# Altium schematic sheet Interface_Accelerometer_2.SchDoc
size A4
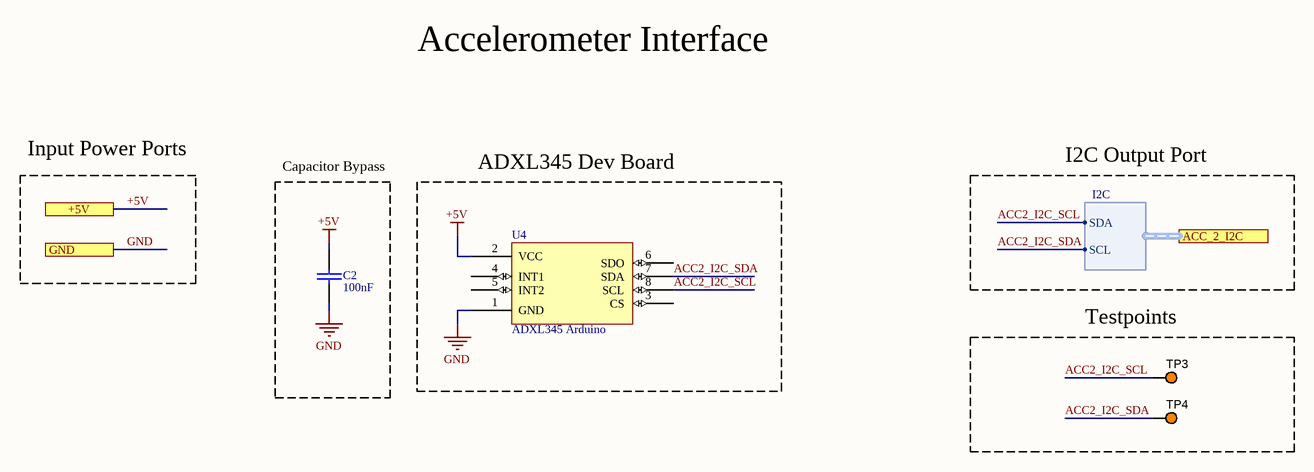
[diagram p0: Interface_Accelerometer_2.SchDoc]

## Parts
C2  100nF  [CAP200]
TP3  5003  [KSTN-5003]  (value not drawn)
TP4  5003  [KSTN-5003]  (value not drawn)
U4  ADXL345 Arduino  [GY-521 MPU6050]

## Blocks framed on the sheet
Capacitor Bypass: C2
ADXL345 Dev Board: U4
Testpoints: TP3 TP4

## Ports
+5V, ACC_2_I2C (harness I2C), GND

## Harnesses
I2C: SDA, SCL

## Nets
+5V: C2.1 U4.2(VCC) ; port +5V
GND: C2.2 U4.1(GND) ; port GND
ACC2_I2C_SCL: TP3.1 U4.8(SCL) ; port ACC_2_I2C.SDA
ACC2_I2C_SDA: TP4.1 U4.7(SDA) ; port ACC_2_I2C.SCL

Not connected (* = marked no-connect by the designer): U4 3(CS) 4(INT1) 5(INT2) 6(SDO)

## Notes on the sheet
- Accelerometer Interface
- Input Power Ports
- I2C Output Port

## Library data of the parts
C2 = CAP
TP3 TP4 = CMP-002-00037-2: Test Point, Orange, Height 4.6 mm, Tail Length 3 mm, 1-Pin THD, RoHS; Manufacturer: Keystone; Colour: Orange; Packaging: Bulk; Package Description: 1-Pin Through Hole Device, Dia 2.54 mm; Pins: 1; Package Reference: 5003; Datasheet Version: Jun-15; Case/Package: 5003; Mounting Technology: TH; Connector Type: TestPoint; Diameter: 2.54mm; Contact Material: Bronze; Datasheet URL: http://keyelco.com/userAssets/file/M65p56.pdf; Manufacturer URL: http://www.keyelco.com/; Package Quantity: 10; Contact Plating: Tin; RoHS Compliant: True
U4 = ADXL345 Arduino: 3-axis accelerometer with high resolution (13-bit) measurement at up to ±16 g. Digital output data is formatted as 16-bit twos complement and is accessible through SPI or I2C digital interface.